# Altium schematic sheet PMIC_Crystal.SchDoc
size 420 x 297 mm; SheetNumber: 14; SheetTotal: 21
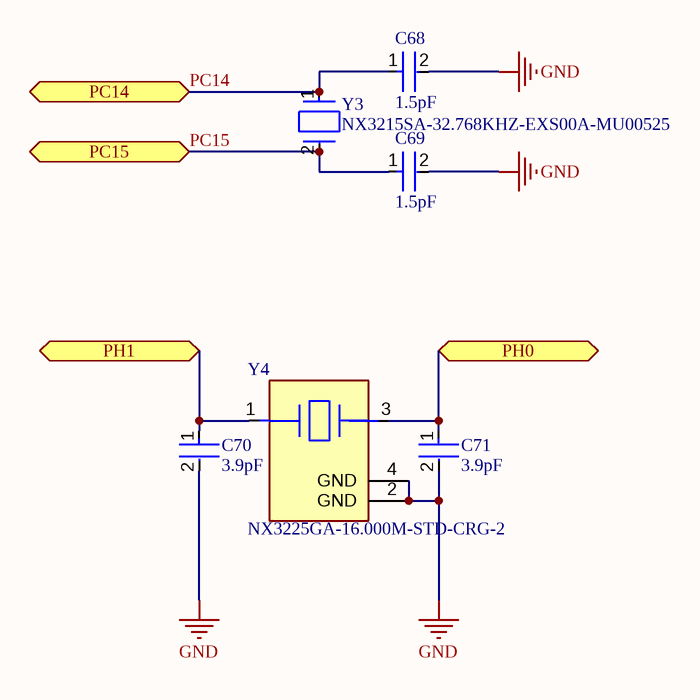
[diagram p0: PMIC_Crystal.SchDoc]

## Parts
C68  1.5pF  [FP-C0603C-CF-MFG]
C69  1.5pF  [FP-C0603C-CF-MFG]
C70  3.9pF  [FP-CBR06C-MFG]
C71  3.9pF  [FP-CBR06C-MFG]
Y3  NX3215SA-32.768KHZ-EXS00A-MU00525  [FP-NX3215SA-MFG]
Y4  NX3225GA-16.000M-STD-CRG-2  [FP-NX3225GA-MFG]

## Ports
PC14 (bidir), PC15 (bidir), PH0 (bidir), PH1 (bidir)

## Nets
GND: C68.2 C69.2 C70.2 C71.2 Y4.2(GND) Y4.4(GND)
PC14: C68.1 Y3.1 ; port PC14
PC15: C69.1 Y3.2 ; port PC15
PH0: C71.1 Y4.3 ; port PH0
PH1: C70.1 Y4.1 ; port PH1

## Notes on the sheet
- THIS DOCUMENT AND THE DATA DISCLOSED HEREIN OR
- HEREWITH IS THE PROPERTY OF ALTIUM LIMITED AND MAY
- DWG NO:
- REVISION
- REV:
- DESCRIPTION
- DATE
- APPROVED
- BE FREELY DISTRIBUTED IN WHOLE. NO RIGHTS ARE
- RESERVED OR EXPRESS OR IMPLIED WARANTEE GIVEN.
- ENG:
- APPROVALS
- PROJECT
- DSN:
- CHK:
- REFERENCE DOCUMENTS
- PROJECT REVISION:
- TITLE
- DOCUMENT REVISION:
- DESIGN ITEM:
- BOM:
- FAB DWG:
- PCB DWG:
- ASSY DWG:
- SCALE:
- A3
- SIZE
- CAGE CODE
- FILE NAME
- DWG NO.
- SHEET
- OF
- REV

## Library data of the parts
C68 C69 = CMP-2006-03373-2: CAP CER 1.5PF 100V NP0 0603; Manufacturer Part Number: C0603C159C1GACTU; Manufacturer: KEMET; Material: Ceramic; Temperature Coefficient: 30ppm/°C; Temperature Characteristic: C0G; Tolerance: 0.25 pF; Automotive Grade: Grade 1; Mouser Description: Multilayer Ceramic Capacitors MLCC - SMD/SMT 100volts 1.5pF C0G 0.25%; Lead Free: Yes; Value: 1.5 pF; Temperature Range Low: -55°C; Temperature: -55°C to +125°C; Device Class L1: Passive Components; Device Class L3: Ceramic Capacitors; Package: C0603C-CF; Category: Cap; ComponentLink2Description: Datasheet; Voltage Rating: 100 V; Device Class L2: Capacitors; Height: 0.87mm; Temperature Range High: +125°C; RoHS: TRUE; Octopart: https://octopart.com/c0603c159c1gactu-kemet-9144220; Digikey Description: CAP CER 1.5PF 100V NP0 0603; Automotive: Yes; ComponentLink2URL: https://api.kemet.com/component-edge/download/datasheet/C0603C100J5GACAUTO.pdf; Capacitance: 1.5 pF
C70 C71 = CMP-2006-02987-2: CAP CER 3.9PF 250V C0G/NP0 0603; Manufacturer Part Number: CBR06C399CAGAC; Manufacturer: KEMET; Material: Ceramic; Tolerance: 0.25 pF; Temperature Characteristic: C0G; Temperature Coefficient: 30ppm/°C; Octopart: https://octopart.com/cbr06c399cagac-kemet-20446767; Height: 0.87mm; Category: Cap; Temperature: -55°C to +125°C; Device Class L1: Passive Components; Capacitance: 3.9 pF; Device Class L3: Ceramic Capacitors; Value: 3.9 pF; Voltage Rating: 250 V; Mouser Description: Multilayer Ceramic Capacitors MLCC - SMD/SMT 250volts 3.9pF C0G 0603 .25pF Tol RF; Temperature Range High: +125°C; Ipc Land Pattern Name: CAPC16080X80; ComponentLink2Description: Datasheet; Temperature Range Low: -55°C; Digikey Description: CAP CER 3.9PF 250V C0G/NP0 0603; ComponentLink2URL: https://content.kemet.com/datasheets/KEM_C1030_CBR_SMD.pdf; Lead Free: Yes; Package: CBR06C; Device Class L2: Capacitors; RoHS: TRUE; Automotive: No
Y3 = CMP-200220-000018-1: CRYSTAL 32.7680KHZ 6PF SMD; ESR (Equivalent Series Resistance): 70kR; Load Capacitance: 6pF; Frequency: 32.768kHz; Case/Package: SMD/SMT; Packaging: Tape and Reel; Ratings: AEC-Q200; Max Operating Temperature: 85°C; Mount: Surface Mount; Min Operating Temperature: -40°C
Y4 = CMP-200220-000007-1: CRYSTAL 16.0000MHZ 8PF SMD; Frequency Stability: 30ppm; Frequency Tolerance: 20ppm; Frequency: 16MHz; ESR (Equivalent Series Resistance): 80R; Min Operating Temperature: -40°C; Mount: Surface Mount; Width: 0.098inch; Case/Package: SMD/SMT; Max Operating Temperature: 85°C; Number of Pins: 4; Length: 0.126inch; Load Capacitance: 8pF; Packaging: Tape and Reel; Package Quantity: 3000; Height: 0.035inch